# Altium schematic sheet mainsheet.SchDoc
size A4
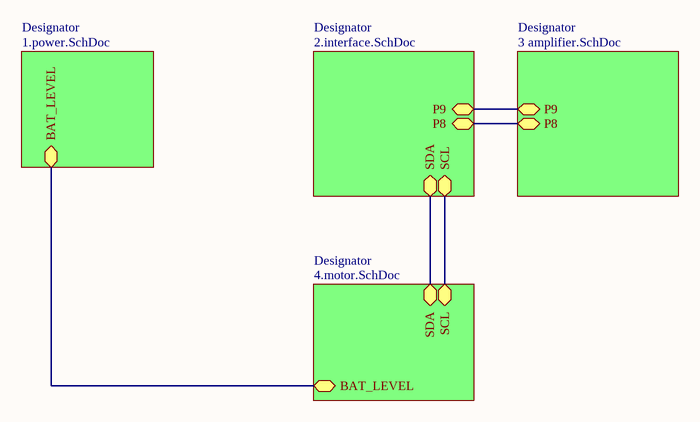
[diagram p0: mainsheet.SchDoc]

## Sub-sheets
Designator = 1.power.SchDoc: BAT_LEVEL (bidir)
Designator = 2.interface.SchDoc: P9 (bidir), P8 (bidir), SCL (bidir), SDA (bidir)
Designator = 3 amplifier.SchDoc: P9 (bidir), P8 (bidir)
Designator = 4.motor.SchDoc: SDA (bidir), SCL (bidir), BAT_LEVEL (bidir)

## Nets
(unnamed): sheet Designator/BAT_LEVEL, sheet Designator/BAT_LEVEL
(unnamed): sheet Designator/P9, sheet Designator/P9
(unnamed): sheet Designator/P8, sheet Designator/P8
(unnamed): sheet Designator/SCL, sheet Designator/SCL
(unnamed): sheet Designator/SDA, sheet Designator/SDA